# Altium schematic sheet PCIE_PACKET_SWITCH.SchDoc: PCIE PACKET SWITCH
size A3; Author: Silvio Navaretti; CompanyName: ARDUINO; DrawnBy: Silvio Navaretti; Engineer: Silvio Navaretti; Organization: ARDUINO; SheetNumber: 25; SheetTotal: 51; RevAuthor: Silvio Navaretti
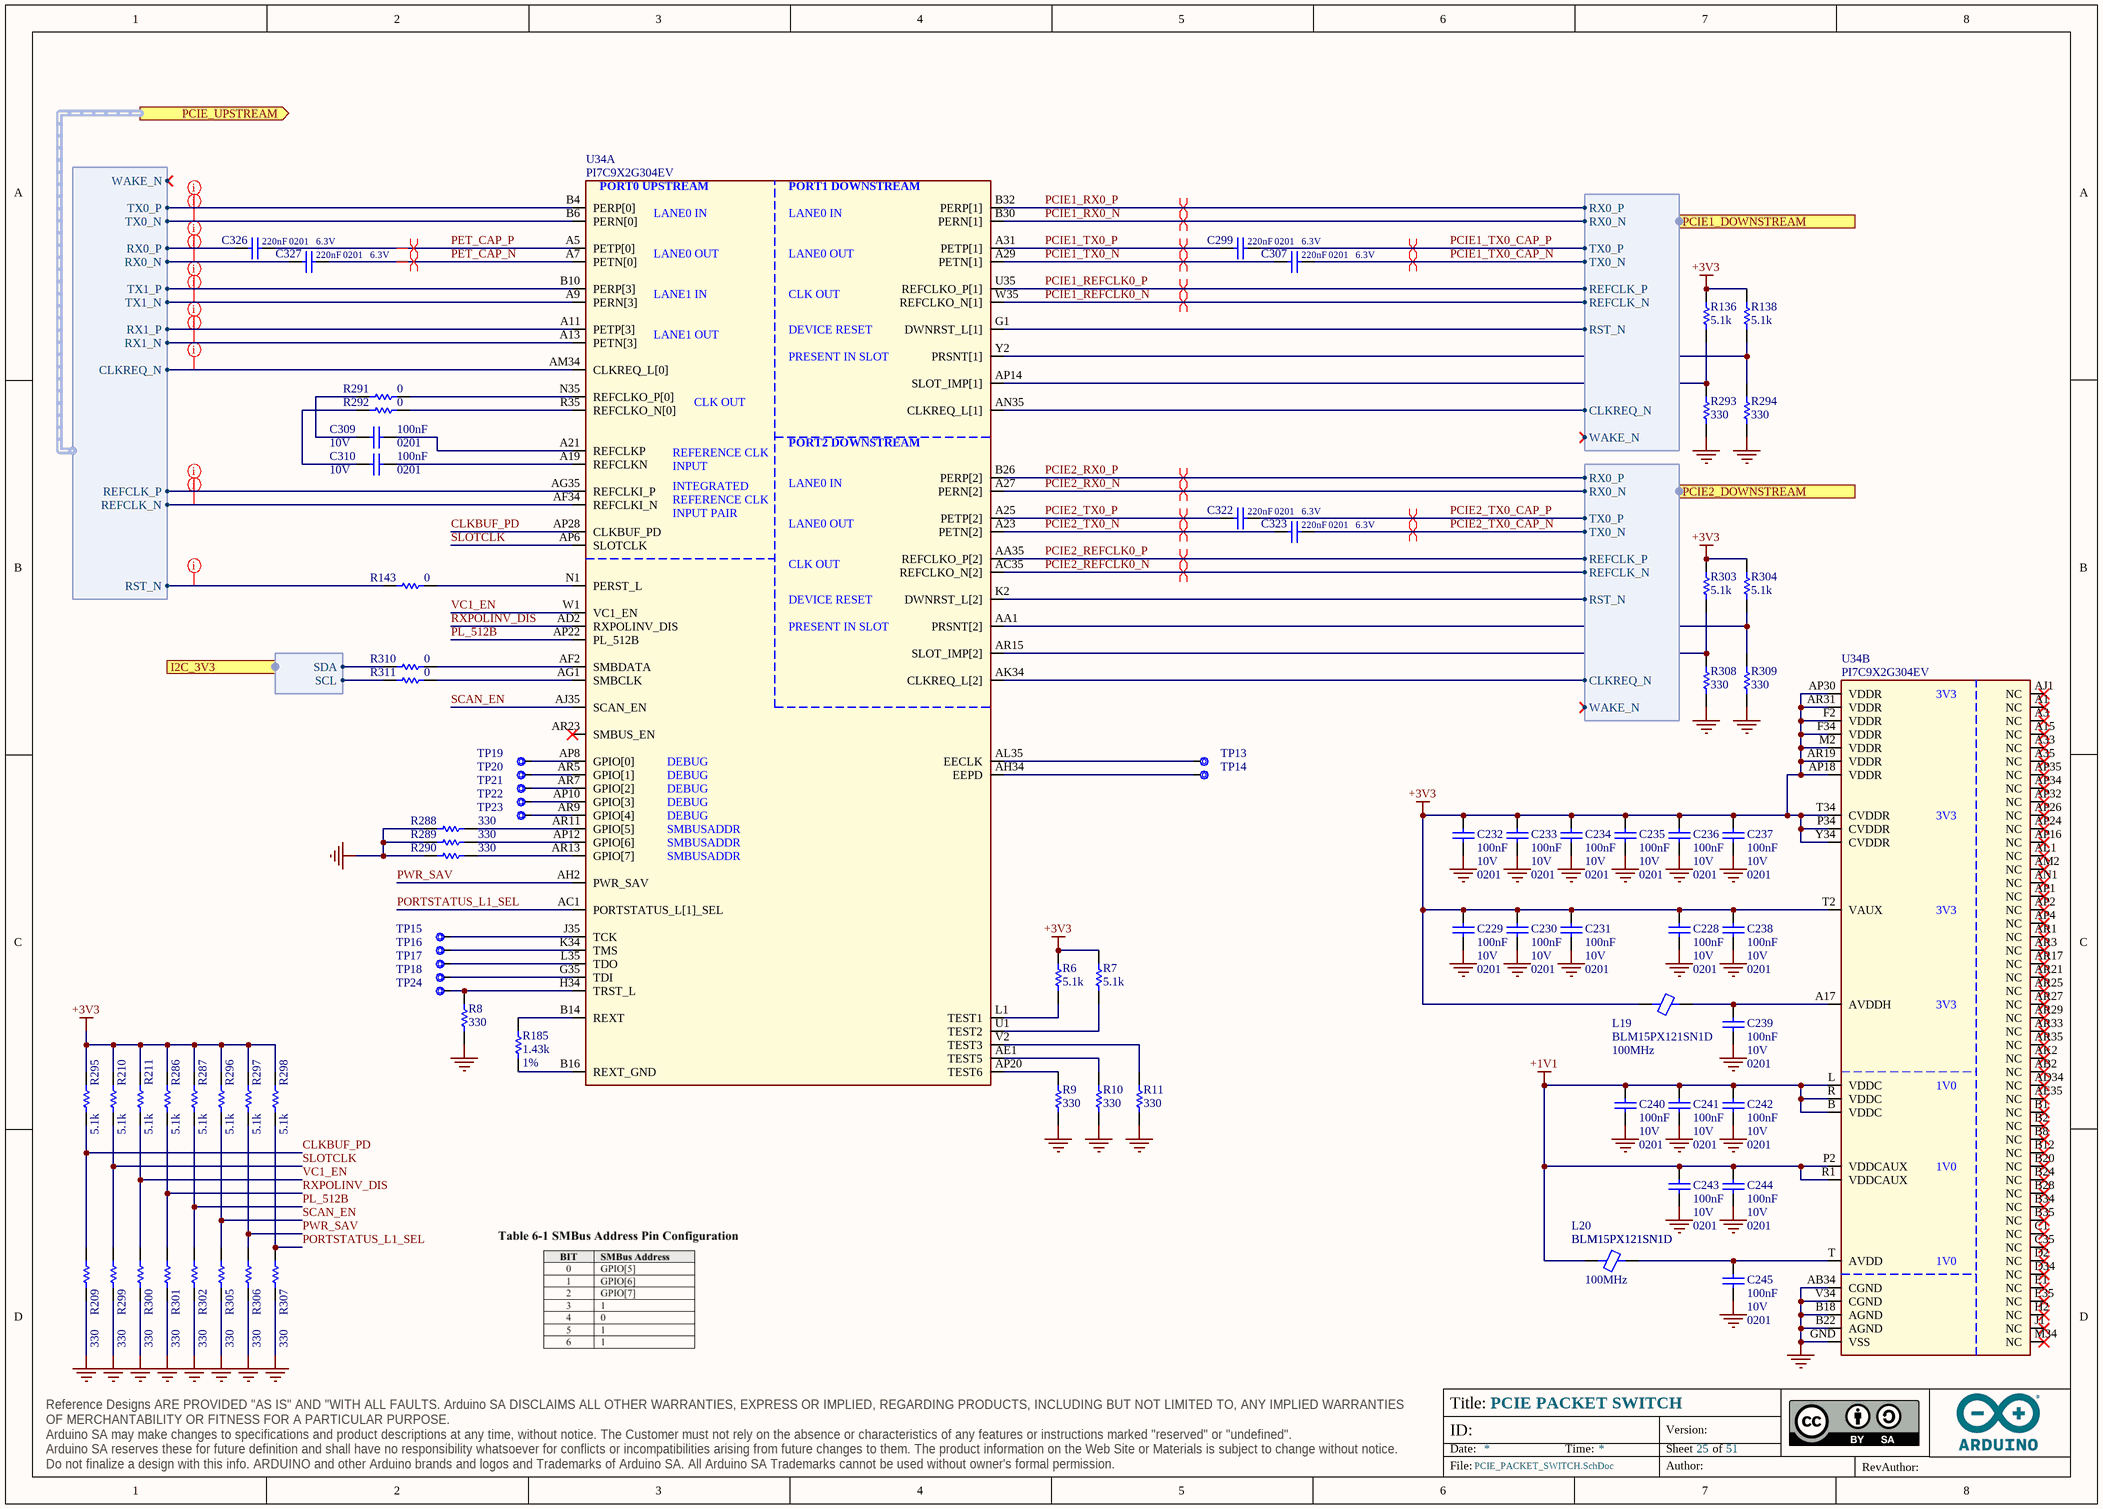
[diagram p0: PCIE_PACKET_SWITCH.SchDoc]

## Parts
C228  value 100nF  Voltage: 10V  Case Code (Imperial): 0201  [CAP-0201]  (hidden comment: CL03A104KP3NNNC)
C229  value 100nF  Voltage: 10V  Case Code (Imperial): 0201  [CAP-0201]  (hidden comment: CL03A104KP3NNNC)
C230  value 100nF  Voltage: 10V  Case Code (Imperial): 0201  [CAP-0201]  (hidden comment: CL03A104KP3NNNC)
C231  value 100nF  Voltage: 10V  Case Code (Imperial): 0201  [CAP-0201]  (hidden comment: CL03A104KP3NNNC)
C232  value 100nF  Voltage: 10V  Case Code (Imperial): 0201  [CAP-0201]  (hidden comment: CL03A104KP3NNNC)
C233  value 100nF  Voltage: 10V  Case Code (Imperial): 0201  [CAP-0201]  (hidden comment: CL03A104KP3NNNC)
C234  value 100nF  Voltage: 10V  Case Code (Imperial): 0201  [CAP-0201]  (hidden comment: CL03A104KP3NNNC)
C235  value 100nF  Voltage: 10V  Case Code (Imperial): 0201  [CAP-0201]  (hidden comment: CL03A104KP3NNNC)
C236  value 100nF  Voltage: 10V  Case Code (Imperial): 0201  [CAP-0201]  (hidden comment: CL03A104KP3NNNC)
C237  value 100nF  Voltage: 10V  Case Code (Imperial): 0201  [CAP-0201]  (hidden comment: CL03A104KP3NNNC)
C238  value 100nF  Voltage: 10V  Case Code (Imperial): 0201  [CAP-0201]  (hidden comment: CL03A104KP3NNNC)
C239  value 100nF  Voltage: 10V  Case Code (Imperial): 0201  [CAP-0201]  (hidden comment: CL03A104KP3NNNC)
C240  value 100nF  Voltage: 10V  Case Code (Imperial): 0201  [CAP-0201]  (hidden comment: CL03A104KP3NNNC)
C241  value 100nF  Voltage: 10V  Case Code (Imperial): 0201  [CAP-0201]  (hidden comment: CL03A104KP3NNNC)
C242  value 100nF  Voltage: 10V  Case Code (Imperial): 0201  [CAP-0201]  (hidden comment: CL03A104KP3NNNC)
C243  value 100nF  Voltage: 10V  Case Code (Imperial): 0201  [CAP-0201]  (hidden comment: CL03A104KP3NNNC)
C244  value 100nF  Voltage: 10V  Case Code (Imperial): 0201  [CAP-0201]  (hidden comment: CL03A104KP3NNNC)
C245  value 100nF  Voltage: 10V  Case Code (Imperial): 0201  [CAP-0201]  (hidden comment: CL03A104KP3NNNC)
C299  value 220nF  Case Code (Imperial): 0201  Voltage: 6.3V  [CAP-0201]  (hidden comment: GRM033R60J224ME15D)
C307  value 220nF  Case Code (Imperial): 0201  Voltage: 6.3V  [CAP-0201]  (hidden comment: GRM033R60J224ME15D)
C309  value 100nF  Voltage: 10V  Case Code (Imperial): 0201  [CAP-0201]  (hidden comment: CL03A104KP3NNNC)
C310  value 100nF  Voltage: 10V  Case Code (Imperial): 0201  [CAP-0201]  (hidden comment: CL03A104KP3NNNC)
C322  value 220nF  Case Code (Imperial): 0201  Voltage: 6.3V  [CAP-0201]  (hidden comment: GRM033R60J224ME15D)
C323  value 220nF  Case Code (Imperial): 0201  Voltage: 6.3V  [CAP-0201]  (hidden comment: GRM033R60J224ME15D)
C326  value 220nF  Case Code (Imperial): 0201  Voltage: 6.3V  [CAP-0201]  (hidden comment: GRM033R60J224ME15D)
C327  value 220nF  Case Code (Imperial): 0201  Voltage: 6.3V  [CAP-0201]  (hidden comment: GRM033R60J224ME15D)
L19  BLM15PX121SN1D  Test Frequency: 100MHz  [L-0402]
L20  BLM15PX121SN1D  Test Frequency: 100MHz  [L-0402]
R6  value 5.1k  [RES-0201]  (hidden comment: ERJ-1GNF5101C)
R7  value 5.1k  [RES-0201]  (hidden comment: ERJ-1GNF5101C)
R8  value 330  [RES-0201]  (hidden comment: AC0201FR-07330RL)
R9  value 330  [RES-0201]  (hidden comment: AC0201FR-07330RL)
R10  value 330  [RES-0201]  (hidden comment: AC0201FR-07330RL)
R11  value 330  [RES-0201]  (hidden comment: AC0201FR-07330RL)
R136  value 5.1k  [RES-0201]  (hidden comment: ERJ-1GNF5101C)
R138  value 5.1k  [RES-0201]  (hidden comment: ERJ-1GNF5101C)
R143  value 0  [RES-0201]  (hidden comment: CRCW02010000Z0ED)
R185  value 1.43k  Tolerance: 1%  [RES-0201]  (hidden comment: RC0201FR-071K43L)
R209  value 330  [RES-0201]  (hidden comment: AC0201FR-07330RL)
R210  value 5.1k  [RES-0201]  (hidden comment: ERJ-1GNF5101C)
R211  value 5.1k  [RES-0201]  (hidden comment: ERJ-1GNF5101C)
R286  value 5.1k  [RES-0201]  (hidden comment: ERJ-1GNF5101C)
R287  value 5.1k  [RES-0201]  (hidden comment: ERJ-1GNF5101C)
R288  value 330  [RES-0201]  (hidden comment: AC0201FR-07330RL)
R289  value 330  [RES-0201]  (hidden comment: AC0201FR-07330RL)
R290  value 330  [RES-0201]  (hidden comment: AC0201FR-07330RL)
R291  value 0  [RES-0201]  (hidden comment: CRCW02010000Z0ED)
R292  value 0  [RES-0201]  (hidden comment: CRCW02010000Z0ED)
R293  value 330  [RES-0201]  (hidden comment: AC0201FR-07330RL)
R294  value 330  [RES-0201]  (hidden comment: AC0201FR-07330RL)
R295  value 5.1k  [RES-0201]  (hidden comment: ERJ-1GNF5101C)
R296  value 5.1k  [RES-0201]  (hidden comment: ERJ-1GNF5101C)
R297  value 5.1k  [RES-0201]  (hidden comment: ERJ-1GNF5101C)
R298  value 5.1k  [RES-0201]  (hidden comment: ERJ-1GNF5101C)
R299  value 330  [RES-0201]  (hidden comment: AC0201FR-07330RL)
R300  value 330  [RES-0201]  (hidden comment: AC0201FR-07330RL)
R301  value 330  [RES-0201]  (hidden comment: AC0201FR-07330RL)
R302  value 330  [RES-0201]  (hidden comment: AC0201FR-07330RL)
R303  value 5.1k  [RES-0201]  (hidden comment: ERJ-1GNF5101C)
R304  value 5.1k  [RES-0201]  (hidden comment: ERJ-1GNF5101C)
R305  value 330  [RES-0201]  (hidden comment: AC0201FR-07330RL)
R306  value 330  [RES-0201]  (hidden comment: AC0201FR-07330RL)
R307  value 330  [RES-0201]  (hidden comment: AC0201FR-07330RL)
R308  value 330  [RES-0201]  (hidden comment: AC0201FR-07330RL)
R309  value 330  [RES-0201]  (hidden comment: AC0201FR-07330RL)
R310  value 0  [RES-0201]  (hidden comment: CRCW02010000Z0ED)
R311  value 0  [RES-0201]  (hidden comment: CRCW02010000Z0ED)
TP13  Test point 1.00mm  [TP-1.00MM]  (value not drawn)  (no BOM)
TP14  Test point 1.00mm  [TP-1.00MM]  (value not drawn)  (no BOM)
TP15  Test point 1.00mm  [TP-1.00MM]  (value not drawn)  (no BOM)
TP16  Test point 1.00mm  [TP-1.00MM]  (value not drawn)  (no BOM)
TP17  Test point 1.00mm  [TP-1.00MM]  (value not drawn)  (no BOM)
TP18  Test point 1.00mm  [TP-1.00MM]  (value not drawn)  (no BOM)
TP19  Test point 1.00mm  [TP-1.00MM]  (value not drawn)  (no BOM)
TP20  Test point 1.00mm  [TP-1.00MM]  (value not drawn)  (no BOM)
TP21  Test point 1.00mm  [TP-1.00MM]  (value not drawn)  (no BOM)
TP22  Test point 1.00mm  [TP-1.00MM]  (value not drawn)  (no BOM)
TP23  Test point 1.00mm  [TP-1.00MM]  (value not drawn)  (no BOM)
TP24  Test point 1.00mm  [TP-1.00MM]  (value not drawn)  (no BOM)
U34  PI7C9X2G304EV  [PI7C9X2G304EV-Footprint-1]  (parts A,B of 2)

## Ports
I2C_3V3 (out, harness I2C), PCIE1_DOWNSTREAM (out, harness PCIE_1LANE), PCIE2_DOWNSTREAM (out, harness PCIE_1LANE), PCIE_UPSTREAM (out, harness SOM_MD_PCIE0)

## Harnesses
PCIE_1LANE: RX0_N, RX0_P, TX0_P, TX0_N, REFCLK_N, REFCLK_P, WAKE_N, CLKREQ_N, RST_N
I2C: SDA, SCL
SOM_MD_PCIE0: RX0_N, RX0_P, TX0_P, TX0_N, RX1_N, RX1_P, TX1_P, TX1_N, REFCLK_N, REFCLK_P, WAKE_N, CLKREQ_N, RST_N

## Nets
+1V1: C240.2 C241.2 C242.2 C243.2 C244.2 L20.1 U34.B(VDDC) U34.L(VDDC) U34.P2(VDDCAUX) U34.R(VDDC) U34.R1(VDDCAUX)
+3V3: C228.2 C229.2 C230.2 C231.2 C232.2 C233.2 C234.2 C235.2 C236.2 C237.2 C238.2 L19.1 R6.2 R7.2 R136.2 R138.2 R210.2 R211.2 R286.2 R287.2 R295.2 R296.2 R297.2 R298.2 R303.2 R304.2 U34.AP18(VDDR) U34.AP30(VDDR) U34.AR19(VDDR) U34.AR31(VDDR) U34.F2(VDDR) U34.F34(VDDR) U34.M2(VDDR) U34.P34(CVDDR) U34.T2(VAUX) U34.T34(CVDDR) U34.Y34(CVDDR)
GND: C228.1 C229.1 C230.1 C231.1 C232.1 C233.1 C234.1 C235.1 C236.1 C237.1 C238.1 C239.1 C240.1 C241.1 C242.1 C243.1 C244.1 C245.1 R8.1 R9.1 R10.1 R11.1 R209.1 R288.2 R289.2 R290.2 R293.1 R294.1 R299.1 R300.1 R301.1 R302.1 R305.1 R306.1 R307.1 R308.1 R309.1 U34.AB34(CGND) U34.B18(AGND) U34.B22(AGND) U34.GND(VSS) U34.V34(CGND)
CLKBUF_PD: R209.2 R295.1 U34.AP28(CLKBUF_PD)
PCIE1_REFCLK0_N: U34.W35(REFCLKO_N[1]) ; port PCIE1_DOWNSTREAM.REFCLK_N
PCIE1_REFCLK0_P: U34.U35(REFCLKO_P[1]) ; port PCIE1_DOWNSTREAM.REFCLK_P
PCIE1_RX0_N: U34.B30(PERN[1]) ; port PCIE1_DOWNSTREAM.RX0_N
PCIE1_RX0_P: U34.B32(PERP[1]) ; port PCIE1_DOWNSTREAM.RX0_P
PCIE1_TX0_CAP_N: C307.1 ; port PCIE1_DOWNSTREAM.TX0_N
PCIE1_TX0_CAP_P: C299.1 ; port PCIE1_DOWNSTREAM.TX0_P
PCIE1_TX0_N: C307.2 U34.A29(PETN[1])
PCIE1_TX0_P: C299.2 U34.A31(PETP[1])
PCIE2_REFCLK0_N: U34.AC35(REFCLKO_N[2]) ; port PCIE2_DOWNSTREAM.REFCLK_N
PCIE2_REFCLK0_P: U34.AA35(REFCLKO_P[2]) ; port PCIE2_DOWNSTREAM.REFCLK_P
PCIE2_RX0_N: U34.A27(PERN[2]) ; port PCIE2_DOWNSTREAM.RX0_N
PCIE2_RX0_P: U34.B26(PERP[2]) ; port PCIE2_DOWNSTREAM.RX0_P
PCIE2_TX0_CAP_N: C323.1 ; port PCIE2_DOWNSTREAM.TX0_N
PCIE2_TX0_CAP_P: C322.1 ; port PCIE2_DOWNSTREAM.TX0_P
PCIE2_TX0_N: C323.2 U34.A23(PETN[2])
PCIE2_TX0_P: C322.2 U34.A25(PETP[2])
PET_CAP_N: C327.1 U34.A7(PETN[0])
PET_CAP_P: C326.1 U34.A5(PETP[0])
PL_512B: R287.1 R302.2 U34.AP22(PL_512B)
PORTSTATUS_L1_SEL: R298.1 R307.2 U34.AC1(PORTSTATUS_L[1]_SEL)
PWR_SAV: R297.1 R306.2 U34.AH2(PWR_SAV)
RXPOLINV_DIS: R286.1 R301.2 U34.AD2(RXPOLINV_DIS)
SCAN_EN: R296.1 R305.2 U34.AJ35(SCAN_EN)
SLOTCLK: R210.1 R299.2 U34.AP6(SLOTCLK)
VC1_EN: R211.1 R300.2 U34.W1(VC1_EN)
NetC239_2: C239.2 L19.2 U34.A17(AVDDH)
NetC245_2: C245.2 L20.2 U34.T(AVDD)
NetC309_1: C309.1 U34.A21(REFCLKP)
NetC309_2: C309.2 R291.1
NetC310_1: C310.1 U34.A19(REFCLKN)
NetC310_2: C310.2 R292.1
NetC326_2: C326.2 ; port PCIE_UPSTREAM.RX0_P
NetC327_2: C327.2 ; port PCIE_UPSTREAM.RX0_N
NetR6_1: R6.1 U34.L1(TEST1)
NetR7_1: R7.1 U34.U1(TEST2)
NetR8_2: R8.2 TP24.X U34.H34(TRST_L)
NetR9_2: R9.2 U34.AP20(TEST6)
NetR10_2: R10.2 U34.AE1(TEST5)
NetR11_2: R11.2 U34.V2(TEST3)
NetR136_1: R136.1 R293.2 U34.AP14(SLOT_IMP[1])
NetR138_1: R138.1 R294.2 U34.Y2(PRSNT[1])
NetR143_1: R143.1 U34.N1(PERST_L)
NetR143_2: R143.2 ; port PCIE_UPSTREAM.RST_N
NetR185_1: R185.1 U34.B14(REXT)
NetR185_2: R185.2 U34.B16(REXT_GND)
NetR288_1: R288.1 U34.AR11(GPIO[5])
NetR289_1: R289.1 U34.AP12(GPIO[6])
NetR290_1: R290.1 U34.AR13(GPIO[7])
NetR291_2: R291.2 U34.N35(REFCLKO_P[0])
NetR292_2: R292.2 U34.R35(REFCLKO_N[0])
NetR303_1: R303.1 R308.2 U34.AR15(SLOT_IMP[2])
NetR304_1: R304.1 R309.2 U34.AA1(PRSNT[2])
NetR310_1: R310.1 U34.AF2(SMBDATA)
NetR310_2: R310.2 ; port I2C_3V3.SDA
NetR311_1: R311.1 U34.AG1(SMBCLK)
NetR311_2: R311.2 ; port I2C_3V3.SCL
NetTP13_X: TP13.X U34.AL35(EECLK)
NetTP14_X: TP14.X U34.AH34(EEPD)
NetTP15_X: TP15.X U34.J35(TCK)
NetTP16_X: TP16.X U34.K34(TMS)
NetTP17_X: TP17.X U34.L35(TDO)
NetTP18_X: TP18.X U34.G35(TDI)
NetTP19_X: TP19.X U34.AP8(GPIO[0])
NetTP20_X: TP20.X U34.AR5(GPIO[1])
NetTP21_X: TP21.X U34.AR7(GPIO[2])
NetTP22_X: TP22.X U34.AP10(GPIO[3])
NetTP23_X: TP23.X U34.AR9(GPIO[4])
NetU34_A9: U34.A9(PERN[3]) ; port PCIE_UPSTREAM.TX1_N
NetU34_A11: U34.A11(PETP[3]) ; port PCIE_UPSTREAM.RX1_P
NetU34_A13: U34.A13(PETN[3]) ; port PCIE_UPSTREAM.RX1_N
NetU34_AF34: U34.AF34(REFCLKI_N) ; port PCIE_UPSTREAM.REFCLK_N
NetU34_AG35: U34.AG35(REFCLKI_P) ; port PCIE_UPSTREAM.REFCLK_P
NetU34_AK34: U34.AK34(CLKREQ_L[2]) ; port PCIE2_DOWNSTREAM.CLKREQ_N
NetU34_AM34: U34.AM34(CLKREQ_L[0]) ; port PCIE_UPSTREAM.CLKREQ_N
NetU34_AN35: U34.AN35(CLKREQ_L[1]) ; port PCIE1_DOWNSTREAM.CLKREQ_N
NetU34_B4: U34.B4(PERP[0]) ; port PCIE_UPSTREAM.TX0_P
NetU34_B6: U34.B6(PERN[0]) ; port PCIE_UPSTREAM.TX0_N
NetU34_B10: U34.B10(PERP[3]) ; port PCIE_UPSTREAM.TX1_P
NetU34_G1: U34.G1(DWNRST_L[1]) ; port PCIE1_DOWNSTREAM.RST_N
NetU34_K2: U34.K2(DWNRST_L[2]) ; port PCIE2_DOWNSTREAM.RST_N

Not connected (* = marked no-connect by the designer): U34 A1(NC)* A3(NC)* A15(NC)* A33(NC)* A35(NC)* AB2(NC)* AD34(NC)* AE35(NC)* AJ1(NC)* AK2(NC)* AL1(NC)* AM2(NC)* AN1(NC)* AP1(NC)* AP2(NC)* AP4(NC)* AP16(NC)* AP24(NC)* AP26(NC)* AP32(NC)* AP34(NC)* AP35(NC)* AR1(NC)* AR3(NC)* AR17(NC)* AR21(NC)* AR23(SMBUS_EN)* AR25(NC)* AR27(NC)* AR29(NC)* AR33(NC)* AR35(NC)* B1(NC)* B2(NC)* B8(NC)* B12(NC)* B20(NC)* B24(NC)* B28(NC)* B34(NC)* B35(NC)* C1(NC)* C35(NC)* D2(NC)* D34(NC)* E1(NC)* E35(NC)* H2(NC)* J1(NC)* M34(NC)*

## Layout directives
differential pair; differential pair class DIFF_PCIE_DOWN1: PCIE1_REFCLK0_N, PCIE1_REFCLK0_P, PCIE1_RX0_N, PCIE1_RX0_P, PCIE1_TX0_CAP_N, PCIE1_TX0_CAP_P, PCIE1_TX0_N, PCIE1_TX0_P
net class NET_PCIE_UP: NetC326_2, NetC327_2, NetR143_2, NetU34_A9, NetU34_A11, NetU34_A13, NetU34_AF34, NetU34_AG35, NetU34_AM34, NetU34_B4, NetU34_B6, NetU34_B10
differential pair; differential pair class DIFF_PCIE_DOWN2: PCIE2_REFCLK0_N, PCIE2_REFCLK0_P, PCIE2_RX0_N, PCIE2_RX0_P, PCIE2_TX0_CAP_N, PCIE2_TX0_CAP_P, PCIE2_TX0_N, PCIE2_TX0_P
differential pair; differential pair class DIFF_PCIE_PET: PET_CAP_N, PET_CAP_P

## Notes on the sheet
- Title:
- ID:
- Date:
- Time:
- Version:
- Sheet
- of
- RevAuthor:
- Reference Designs ARE PROVIDED "AS IS" AND "WITH ALL FAULTS. Arduino SA DISCLAIMS ALL OTHER WARRANTIES, EXPRESS OR IMPLIED, REGARDING PRODUCTS, INCLUDING BUT NOT LIMITED TO, ANY IMPLIED WARRANTIES OF MERCHANTABILITY OR FITNESS FOR A PARTICULAR PURPOSE.
  Arduino SA may make changes to specifications and product descriptions at any time, without notice. The Customer must not rely on the absence or characteristics of any features or instructions marked "reserved" or "undefined".
  Arduino SA reserves these for future definition and shall have no responsibility whatsoever for conflicts or incompatibilities arising from future changes to them. The product information on the Web Site or Materials is subject to change without notice.
  Do not finalize a design with this info. ARDUINO and other Arduino brands and logos and Trademarks of Arduino SA. All Arduino SA Trademarks cannot be used without owner's formal permission.
- File:
- Author:
- (in symbol U0511-A.14, part A) PORT0 UPSTREAM; PORT1 DOWNSTREAM; LANE0 IN; LANE0 OUT; LANE1 IN; CLK OUT; DEVICE RESET; LANE1 OUT; PRESENT IN SLOT; PORT2 DOWNSTREAM; REFERENCE CLK / INPUT; INTEGRATED REFERENCE CLK INPUT PAIR; DEBUG; SMBUSADDR
- (in symbol U0511-A.14, part B) 3V3; 1V0

## Library data of the parts
C228-C245 C309 C310 = C0113-A.6: CAP CHIP 0201 100nF 10% 10V X5R; Manufacturer: Samsung Electro-Mechanics; Code Arduino: C0113; Technology: Ceramic; Part Number: CL03A104KP3NNNC; Dielectric: X5R; Tolerance: 10%
C299 C307 C322 C323 C326 C327 = C0004-A.15: CAP CHIP 0201 220nF 20% 6.3V X5R; Manufacturer: Murata; Code Arduino: C0004; Technology: Ceramic; Tolerance: 20%; Part Number: GRM033R60J224ME15D; Dielectric: X5R
L19 L20 = I0028-A.10: FERRITE SMD 0402 120Ohm 25% 100MHz Ferrite 2A; Manufacturer: Murata; Inductance: 120µH; DC Resistance (DCR): 55mR; Code Arduino: I0028; Value: 120µH; Device Type: Ferrite; Packaging: Tape and Reel; Case Code (Imperial): 0402; Max DC Current: 2A; Case Code (Metric): 1005; Package Quantity: 10000; Current: 2A; Max Operating Temperature: 125°C; Tolerance: 25%; Min Operating Temperature: -55°C
  L20: Part Number: BLM15PX121SN1D
R6 R7 R136 R138 R210 R211 R286 R287 R295-R298 R303 R304 = R0376-A.1: RES CHIP 0201 5k1 1% 1/20W; Manufacturer: Panasonic; Code Arduino: R0376; Power: 50mW; Temperature Coefficient: 200ppm; Technology: Thick film; Part Number: ERJ-1GNF5101C; Case Code (Imperial): 0201; Tolerance: 1%
R8-R11 R209 R288-R290 R293 R294 R299-R302 R305-R309 = R0149-A.21: RES CHIP 0201 330R 1% 1/20W; Manufacturer: Yageo; Code Arduino: R0149; Power: 50mW; Temperature coefficient: 200ppm; Case Code (Imperial): 0201; Technology: Thick film; Part Number: AC0201FR-07330RL; Manufacturer 2: Samsung Electro-Mechanics; Tolerance: 1%
R143 R291 R292 R310 R311 = R0140-A.21: RES CHIP 0201 0R; Manufacturer: Vishay; Temperature coefficient: 0ppm; Code Arduino: R0140; Power: 50mW; Tolerance: 0%; Technology: Thick film; Case Code (Imperial): 0201; Part Number: CRCW02010000Z0ED
R185 = R0400-A.1: RES CHIP 0201 1k43 1% 1/20W; Manufacturer: YAGEO; Power: 50mW; Temperature Coefficient: 200ppm; Code Arduino: R0400; Technology: Thick film; Case Code (Imperial): 0201; Part Number: RC0201FR-071K43L
TP13-TP24 = UT0013-A.6: Part Number: This is not a component; Design Item ID: CMP-018-0005-A.3; Source: ut.SchLib; Manufacturer: This is not a component; Code Arduino: This is not a component; Pin Count: 1
U34 = U0511-A.14: IC 3PCIe 2.0 Packet Switch 3-Port, 4-Lane aQFN136 10x10mm; Manufacturer: Diodes Incorporated; Code Arduino: U0511; Part Number: PI7C9X2G304EV